# EasyEDA schematic SCH_directMessage.json

## Sheets
1 Sheet_1: TITLE: directMessage/MCU, display, power management; REV: 1.0; Date: 2022-07-14; Sheet: 1/1; Drawn By: dolendra vikas; Company: Your Company
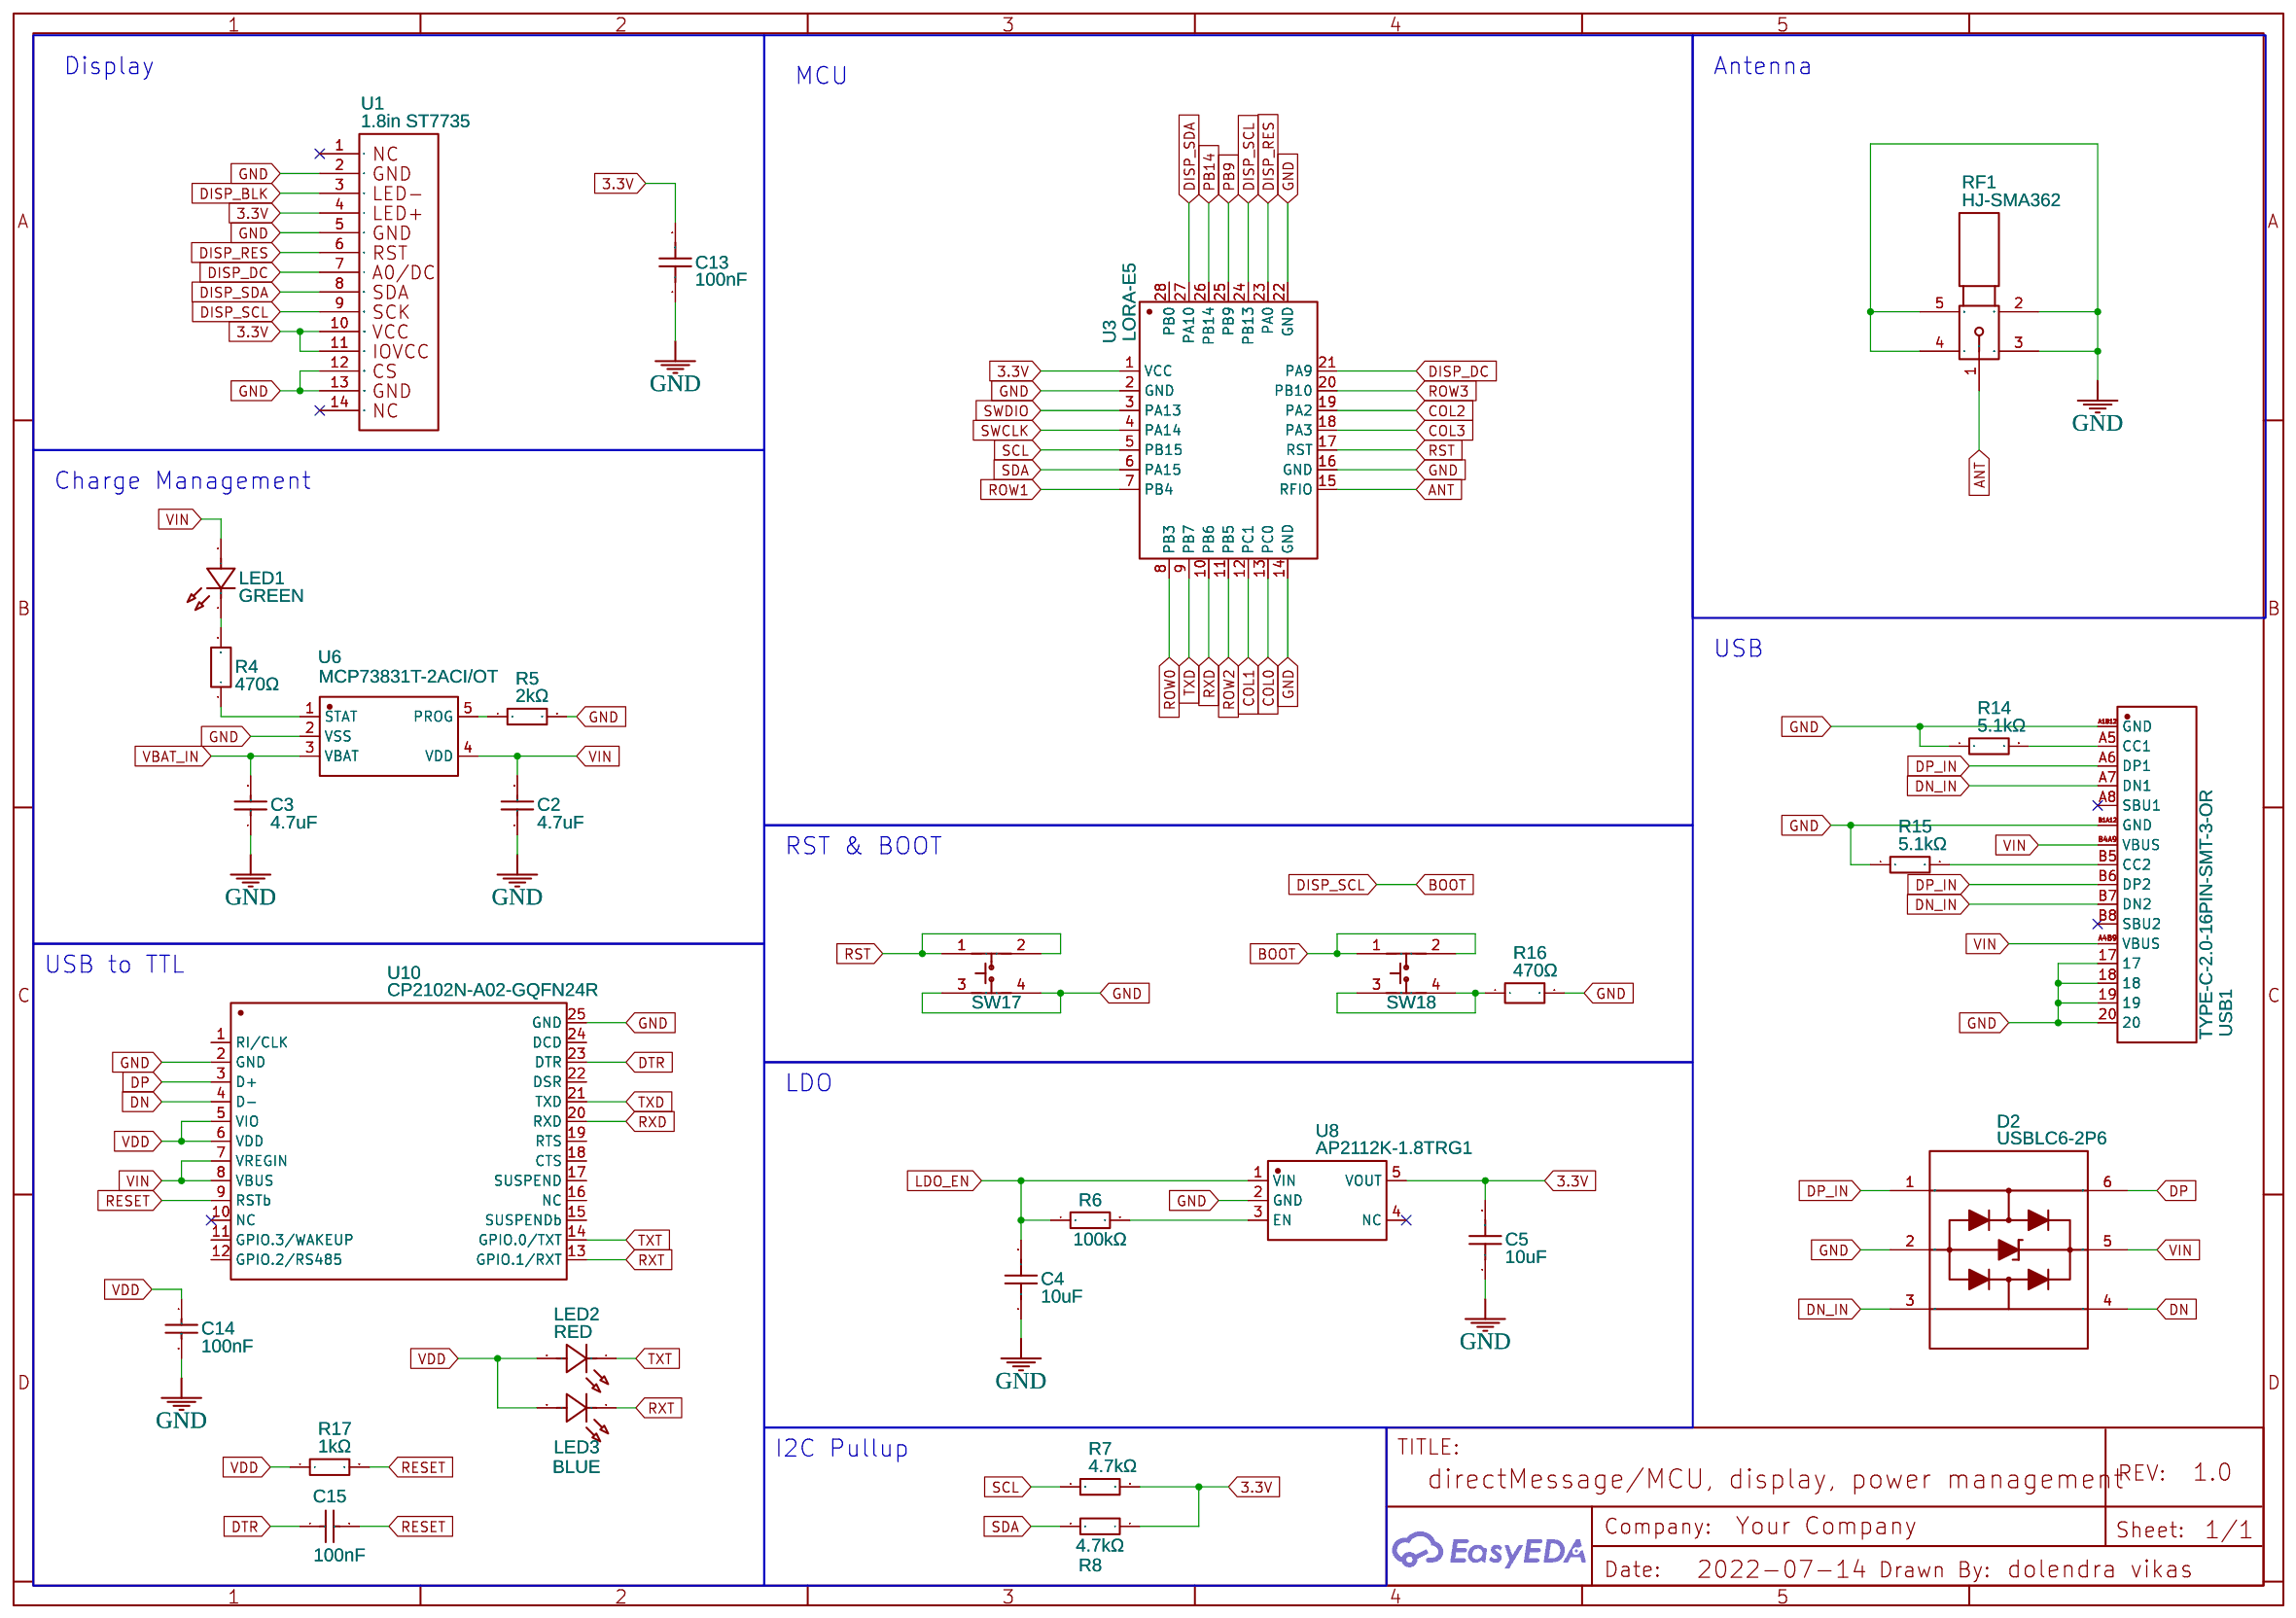
[diagram p0: Sheet_1]
2 Sheet_2: TITLE: directMessage/Sensors & Motor; Date: 2022-07-16
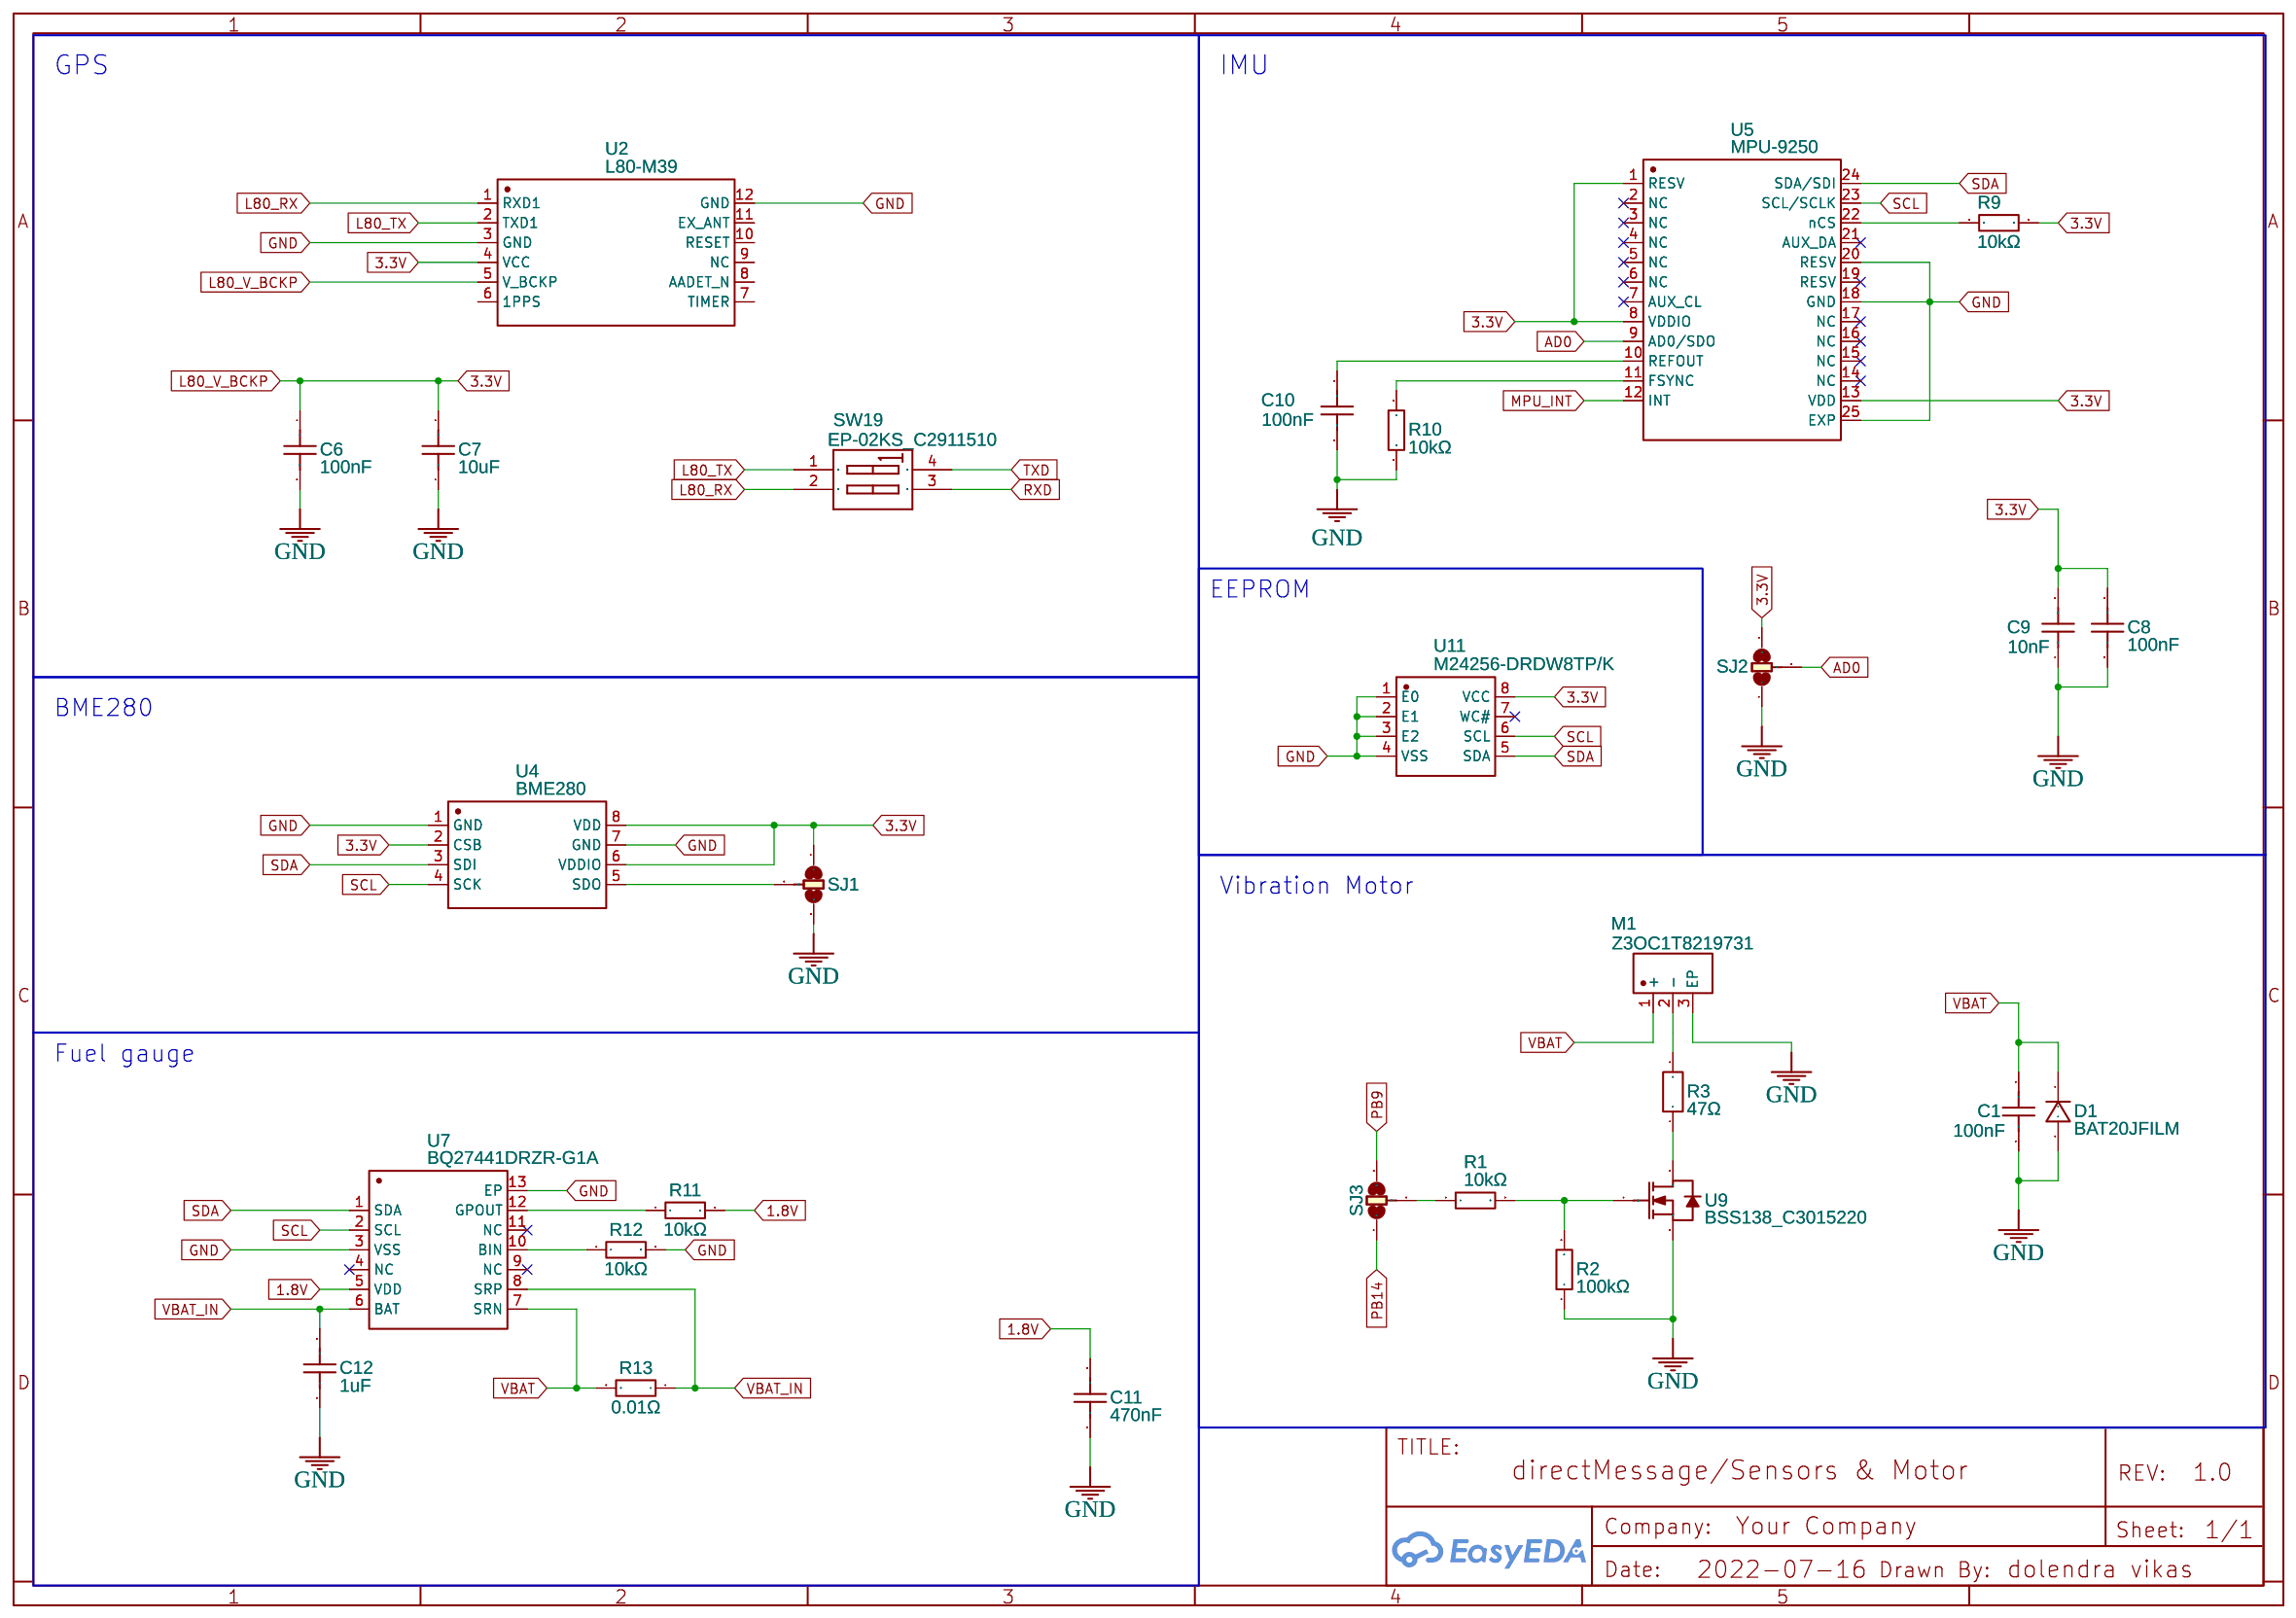
[diagram p1: Sheet_2]
3 Sheet_3: TITLE: directMessage/Conenctors & switches; Date: 2022-07-16
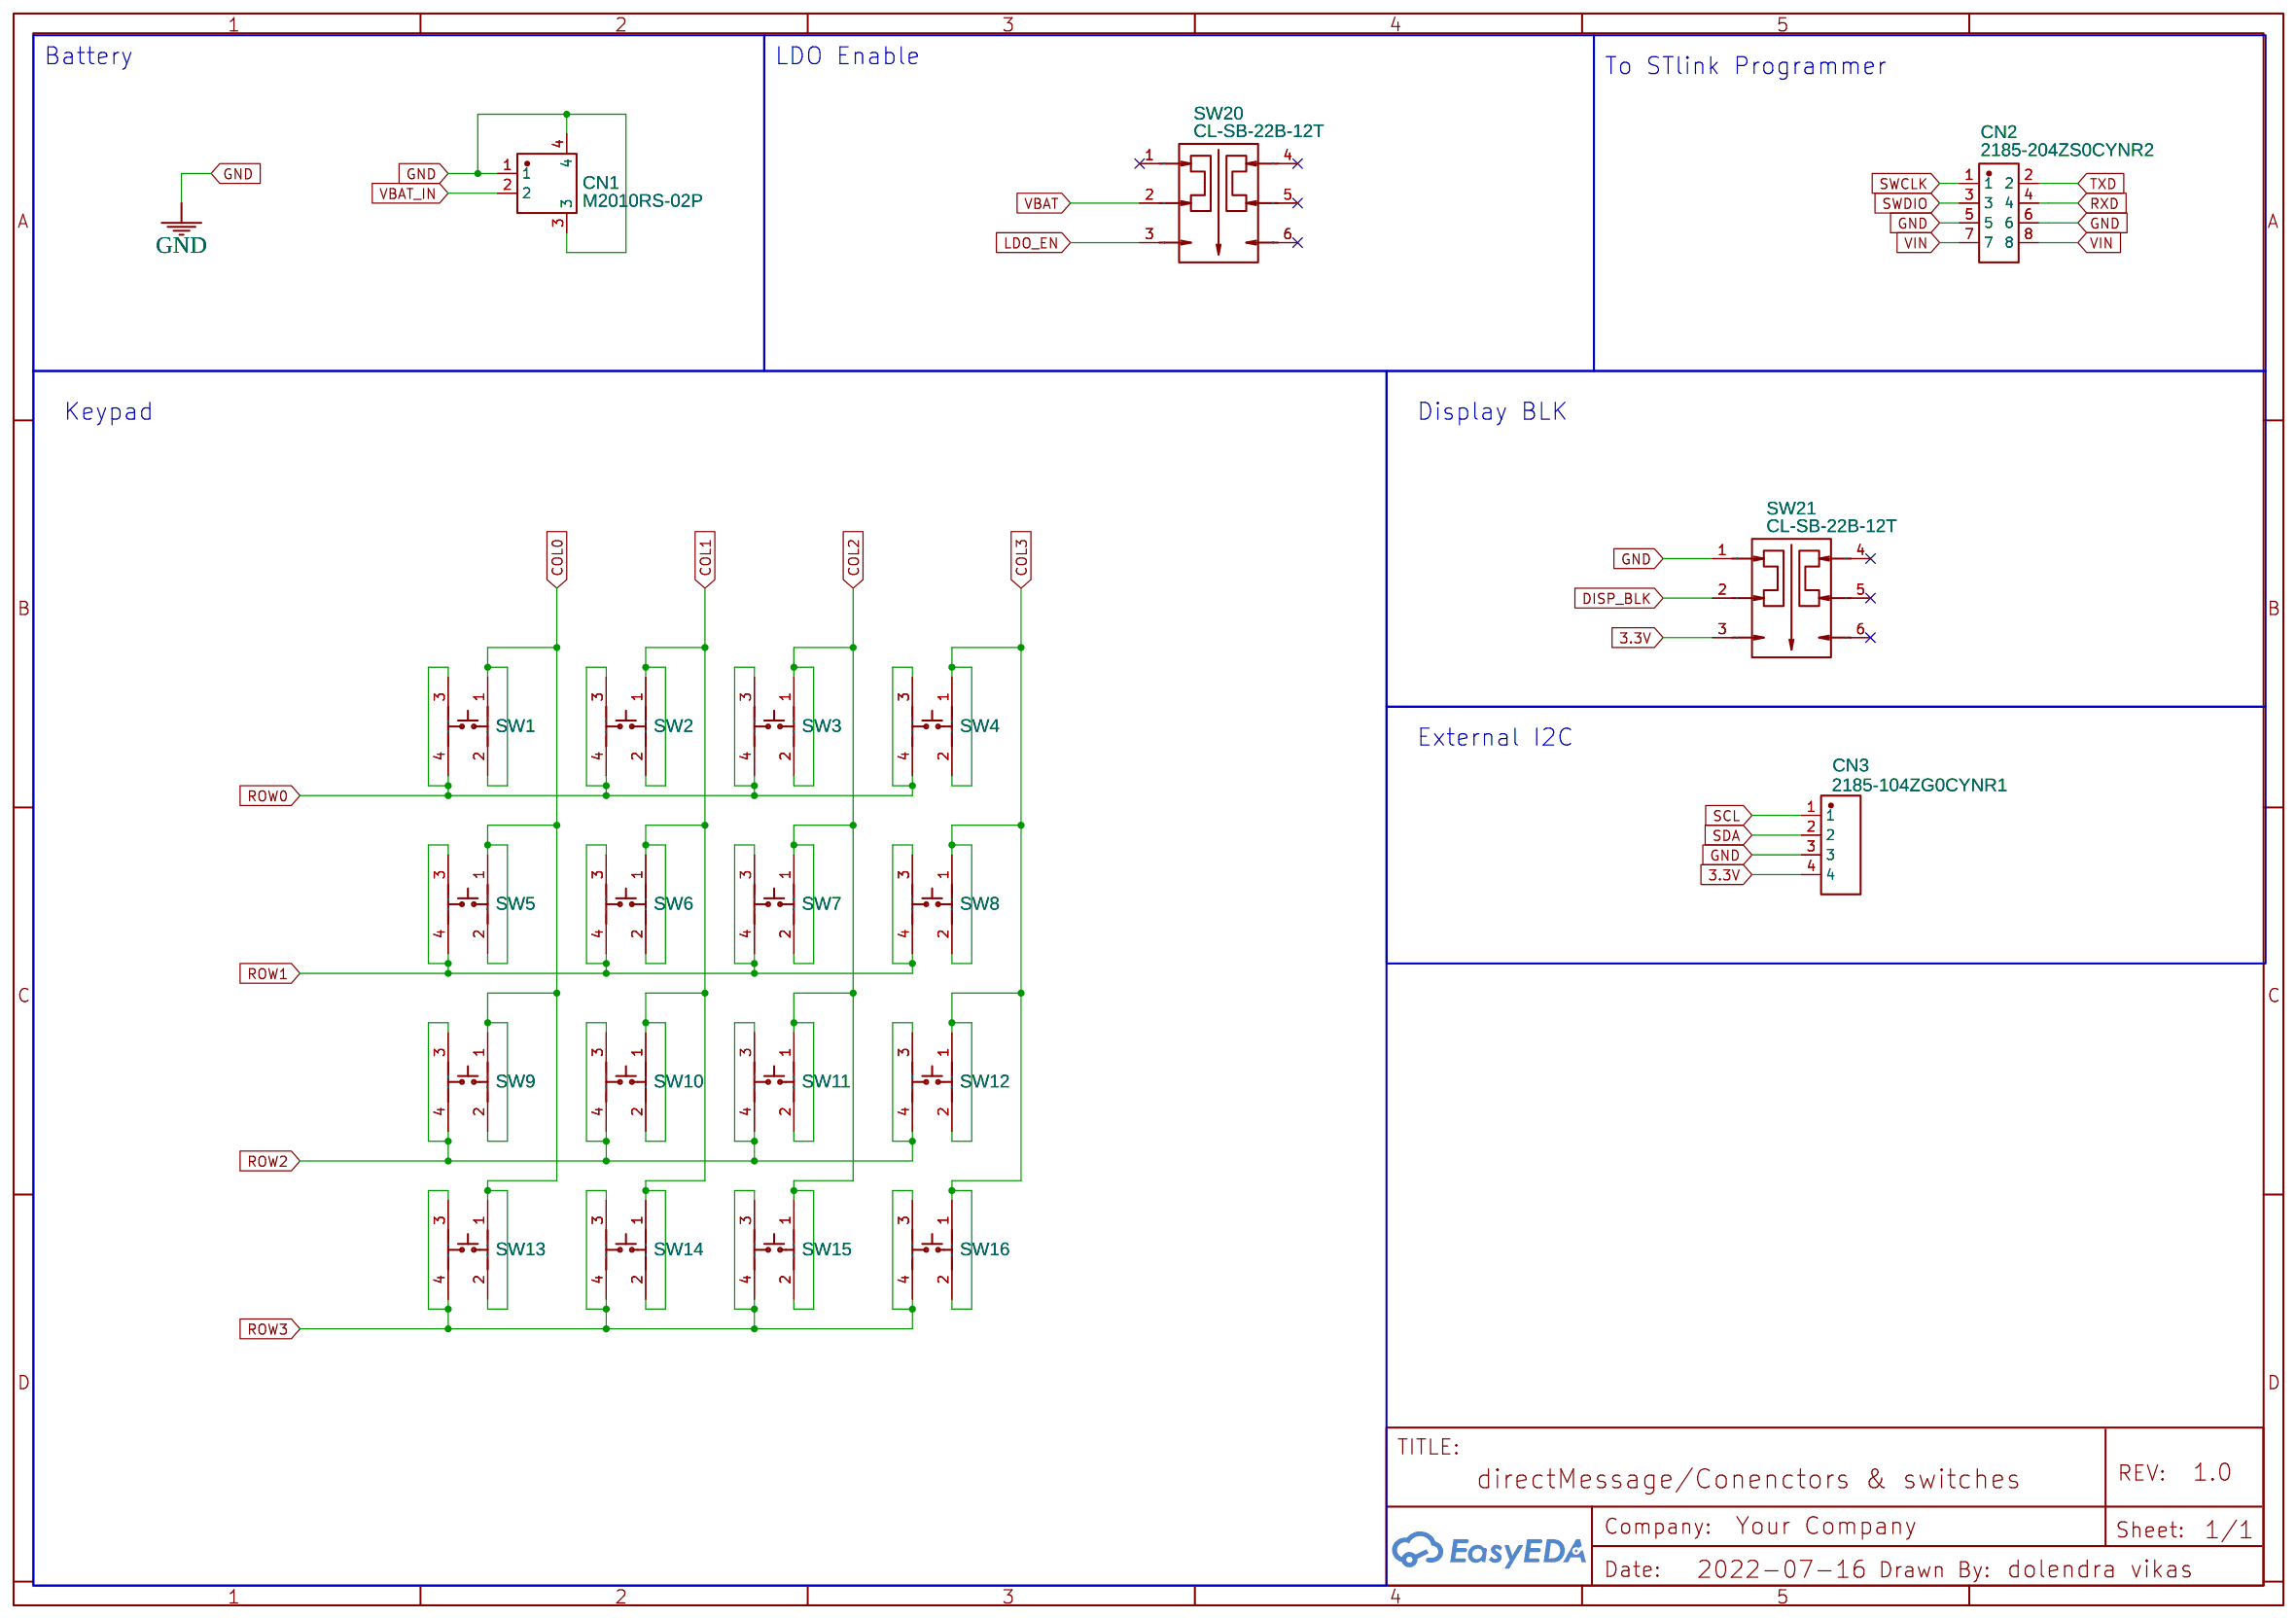
[diagram p2: Sheet_3]

## Parts
sheet Sheet_1
C2  4.7uF  [0603]
C3  4.7uF  [0603]
C4  10uF  [C0603]
C5  10uF  [C0603]
C13  100nF  [C0603]
C14  100nF  [C0603]
C15  100nF  [C0603]
D2  USBLC6-2P6  [SOT-666-6_L1.6-W1.2-P0.50-LS1.6-BR]
LED1  GREEN  [LED0603-RD_GREEN]
LED2  RED  [LED0603-RD_RED]
LED3  BLUE  [LED0603-RD_BLUE]
R4  470Ω  [R0603]
R5  2kΩ  [R0603]
R6  100kΩ  [R0603_NEW]
R7  4.7kΩ  [R0603]
R8  4.7kΩ  [R0603]
R14  5.1kΩ  [R0603]
R15  5.1kΩ  [R0603]
R16  470Ω  [R0603]
R17  1kΩ  [R0603]
RF1  HJ-SMA362  [SMA-SMD_HJ-SMA362]
SW17  SKRPABE010  [KEY-SMD_4P-L4.2-W3.2-P2.20-LS4.6]
SW18  SKRPABE010  [KEY-SMD_4P-L4.2-W3.2-P2.20-LS4.6]
U1  1.8in ST7735  [ST7735_1.8]
U3  LORA-E5  [SMD-28_L12.0-W12.0-P1.25_LORA-E5]
U6  MCP73831T-2ACI/OT  [SOT-23-5_L3.0-W1.7-P0.95-LS2.8-BR]
U8  AP2112K-1.8TRG1  [SOT-25_L3.0-W1.6-P0.95-LS2.8-BL]
U10  CP2102N-A02-GQFN24R  [QFN-24_L4.0-W4.0-P0.50-TL-EP2.6]
USB1  TYPE-C-2.0-16PIN-SMT-3-OR  [USB-SMD_TYPE-C16PIN-1]
sheet Sheet_2
C1  100nF  [C0603]
C6  100nF  [C0603]
C7  10uF  [C0603]
C8  100nF  [C0603]
C9  10nF  [C0603]
C10  100nF  [C0603]
C11  470nF  [C0603]
C12  1uF  [C0603]
D1  BAT20JFILM  [SOD-323_L1.8-W1.3-LS2.5-RD]
M1  Z3OC1T8219731  [VIBRATING-MOTOR-SMD_3P-C9900001680]
R1  10kΩ  [R0603]
R2  100kΩ  [R0603_NEW]
R3  47Ω  [R0603]
R9  10kΩ  [R0603]
R10  10kΩ  [R0603]
R11  10kΩ  [R0603]
R12  10kΩ  [R0603]
R13  0.01Ω  [R0603]
SJ1  SOLDERJUMPER_2WAY-OLDS  [SJ_3]
SJ2  SOLDERJUMPER_2WAY-OLDS  [SJ_3]
SJ3  SOLDERJUMPER_2WAY-OLDS  [SJ_3]
SW19  EP-02KS_C2911510  [SW-SMD_EP-02KS-LS5.4]
U2  L80-M39  [GSM-SMD_L80-M39]
U4  BME280  [LGA-8_BME280_BL]
U5  MPU-9250  [QFN-24_L3.0-W3.0-P0.40-BL-EP]
U7  BQ27441DRZR-G1A  [SON-12_L4.0-W2.5-P0.40-BL-EP]
U9  BSS138_C3015220  [SOT-23-3_L2.9-W1.3-P1.90-LS2.6-BR]
U11  M24256-DRDW8TP/K  [TSSOP-8_L4.4-W3.0-P0.65-LS6.4-BL-2]
sheet Sheet_3
CN1  M2010RS-02P  [CONN-SMD_M2010RS-02P]
CN2  2185-204ZS0CYNR2  [CONN-SMD_8P-P2.54-S3.50_L8.5-W10.2]
CN3  2185-104ZG0CYNR1  [CONN-SMD_4P-P2.54_L8.5-W10.2]
SW1  SKRPABE010  [KEY-SMD_4P-L4.2-W3.2-P2.20-LS4.6]
SW2  SKRPABE010  [KEY-SMD_4P-L4.2-W3.2-P2.20-LS4.6]
SW3  SKRPABE010  [KEY-SMD_4P-L4.2-W3.2-P2.20-LS4.6]
SW4  SKRPABE010  [KEY-SMD_4P-L4.2-W3.2-P2.20-LS4.6]
SW5  SKRPABE010  [KEY-SMD_4P-L4.2-W3.2-P2.20-LS4.6]
SW6  SKRPABE010  [KEY-SMD_4P-L4.2-W3.2-P2.20-LS4.6]
SW7  SKRPABE010  [KEY-SMD_4P-L4.2-W3.2-P2.20-LS4.6]
SW8  SKRPABE010  [KEY-SMD_4P-L4.2-W3.2-P2.20-LS4.6]
SW9  SKRPABE010  [KEY-SMD_4P-L4.2-W3.2-P2.20-LS4.6]
SW10  SKRPABE010  [KEY-SMD_4P-L4.2-W3.2-P2.20-LS4.6]
SW11  SKRPABE010  [KEY-SMD_4P-L4.2-W3.2-P2.20-LS4.6]
SW12  SKRPABE010  [KEY-SMD_4P-L4.2-W3.2-P2.20-LS4.6]
SW13  SKRPABE010  [KEY-SMD_4P-L4.2-W3.2-P2.20-LS4.6]
SW14  SKRPABE010  [KEY-SMD_4P-L4.2-W3.2-P2.20-LS4.6]
SW15  SKRPABE010  [KEY-SMD_4P-L4.2-W3.2-P2.20-LS4.6]
SW16  SKRPABE010  [KEY-SMD_4P-L4.2-W3.2-P2.20-LS4.6]
SW20  CL-SB-22B-12T  [SW-SMD_NIDEC_CL-SB-22B-12T]
SW21  CL-SB-22B-12T  [SW-SMD_NIDEC_CL-SB-22B-12T]

## Library data of the parts
C2 C3 = 0603 4.7UF CAPACITOR (SMD): Supplier Part: C108344; Supplier: LCSC; Manufacturer: FH; Manufacturer Part: 0603F475M100NT
C4 C5 C7 = 0603X106M6R3: Supplier: LCSC; Supplier Part: C123608; Manufacturer: Huaxin S&T; Contributor: LCSC; JLCPCB Part Class: Extended Part
C13 = GCM188R71H104KA57D: Supplier: LCSC; Manufacturer: MuRata; Supplier Part: C85864; JLCPCB Part Class: Extended Part
C14 C15 = FN18X104K500PBG: Supplier: LCSC; Supplier Part: C235731; Manufacturer: Prosperity Dielectrics; Contributor: LCSC; JLCPCB Part Class: Extended Part
D2 = USBLC6-2P6: Supplier: LCSC; Manufacturer: STMicroelectronics; Supplier Part: C15999; Paste Type: Extended Part; JLCPCB Part Class: Extended Part; Contributor: Станислав Яценко
LED1 = XL-1608SYGC-06: Supplier: LCSC; Supplier Part: C965805; Manufacturer: XINGLIGHT(成兴光); JLCPCB Part Class: Extended Part; Contributor: LCSC
LED2 = XL-1608SURC-06: Supplier: LCSC; Supplier Part: C965799; Manufacturer: XINGLIGHT(成兴光); JLCPCB Part Class: Extended Part; Contributor: LCSC
LED3 = XL-1608UBC-04: Supplier: LCSC; Supplier Part: C965807; Manufacturer: XINGLIGHT(成兴光); Contributor: LCSC; JLCPCB Part Class: Extended Part
R4 R16 = ERJPA3J471V: Supplier: LCSC; Supplier Part: C441888; Manufacturer: PANASONIC; Resistance (Ohms): 470; Contributor: LCSC; JLCPCB Part Class: Extended Part
R5 = ERJ-3EKF2001V: Supplier: LCSC; Supplier Part: C192167; Manufacturer: PANASONIC; Resistance (Ohms): 2K; Contributor: LCSC; JLCPCB Part Class: Extended Part
R2 R6 = ERJ3EKF1003V: Supplier: LCSC; Supplier Part: C189597; Manufacturer: PANASONIC; Resistance (Ohms): 100K; Contributor: LCSC; JLCPCB Part Class: Extended Part
R7 R8 = ERJ-3RBD4701V: Supplier: LCSC; Supplier Part: C191778; Manufacturer: PANASONIC; Resistance (Ohms): 4.7K; Contributor: LCSC; JLCPCB Part Class: Extended Part
R14 R15 = ERJ-3RBD5101V: Supplier: LCSC; Supplier Part: C191782; Manufacturer: PANASONIC; Resistance (Ohms): 5.1K; Contributor: LCSC; JLCPCB Part Class: Extended Part
R17 = ERJ-3EKF1001V: Supplier: LCSC; Supplier Part: C118155; Manufacturer: PANASONIC; Resistance (Ohms): 1K; Contributor: LCSC; JLCPCB Part Class: Extended Part
RF1 = HJ-SMA362: Supplier: LCSC; Supplier Part: C2905338; Manufacturer: 皇捷; Contributor: LCSC; JLCPCB Part Class: Extended Part
SW1-SW18 = SKRPABE010: Supplier: LCSC; Manufacturer: ALPS; Supplier Part: C115360; JLCPCB Part Class: Extended Part
U1 = 1.8in ST7735: Contributor: dolendra vikas
U3 = LORA-E5: Supplier: LCSC; Supplier Part: C9900002286; Manufacturer: null; Manufacturer Part: LoRa-E5; JLCPCB Part Class: Extended Part; Contributor: LCSC
U6 = MCP73831T-2ACI/OT: Supplier: LCSC; Supplier Part: C424093; Manufacturer: Microchip Tech; Contributor: LCSC; JLCPCB Part Class: Extended Part
U8 = AP2112K-1.8TRG1: Supplier: LCSC; Supplier Part: C176944; Manufacturer: Diodes Incorporated; Contributor: LCSC; JLCPCB Part Class: Extended Part
U10 = CP2102N-A02-GQFN24R: Supplier: LCSC; Supplier Part: C969151; Manufacturer: SILICON LABS(芯科); Contributor: LCSC; JLCPCB Part Class: Extended Part
USB1 = TYPE-C-2.0-16PIN-SMT-3-OR: Supplier: LCSC; Supplier Part: C2987387; Manufacturer: CIKI(皓富); Contributor: lcsc; JLCPCB Part Class: Extended Part
C1 C6 C8 C10 = C0603C104J5RAC: Supplier: LCSC; Supplier Part: C490602; Manufacturer: KEMET; Contributor: LCSC; JLCPCB Part Class: Extended Part
C9 = C0603C103J3GAC7867: Supplier: LCSC; Supplier Part: C140951; Manufacturer: KEMET; Contributor: LCSC; JLCPCB Part Class: Extended Part
C11 = GCM188R71E474KA64D: Supplier: LCSC; Supplier Part: C161219; Manufacturer: Murata Electronics; Contributor: LCSC; JLCPCB Part Class: Extended Part
C12 = GRM188R61E105KA12D: Supplier: LCSC; Manufacturer: MuRata; Supplier Part: C77046; JLCPCB Part Class: Extended Part
D1 = BAT20JFILM: Supplier Part: C155590; Supplier: LCSC; Manufacturer: STMicroelectronics; Contributor: LCSC; JLCPCB Part Class: Extended Part
M1 = Z3OC1T8219731: Supplier: LCSC; Supplier Part: C2894731; Manufacturer: KOTL(金龙机电); JLCPCB Part Class: Extended Part; Contributor: LCSC
R1 R9-R12 = ERJ3GEYJ103V: Supplier: LCSC; Manufacturer: PANASONIC; Resistance (Ohms): 10K; Contributor: LCSC; Supplier Part: C169849; JLCPCB Part Class: Extended Part
R3 = ERJUP3D47R0V: Supplier: LCSC; Supplier Part: C491217; Manufacturer: PANASONIC; Contributor: LCSC; JLCPCB Part Class: Extended Part
R13 = RTT03R010FTP: Supplier: LCSC; Manufacturer: RALEC; Resistance (Ohms): 0.01; Contributor: LCSC; Supplier Part: C158899; JLCPCB Part Class: Extended Part
SJ1-SJ3 = SOLDERJUMPER_2WAY-OLDS: Solder Jumper; Contributor: SparkFun
SW19 = EP-02KS_C2911510: Supplier: LCSC; Supplier Part: C2911510; Manufacturer: 韩国韩荣; Manufacturer Part: EP-02KS; Contributor: LCSC; JLCPCB Part Class: Extended Part
U2 = L80-M39: Supplier: LCSC; Manufacturer: Quectel; Supplier Part: C133488; JLCPCB Part Class: Extended Part
U4 = BME280: Supplier: LCSC; Manufacturer: Bosch; Contributor: LCSC; Supplier Part: C92489; JLCPCB Part Class: Extended Part
U5 = MPU-9250: Supplier: LCSC; Manufacturer: InvenSense; Contributor: LCSC; Supplier Part: C71459; JLCPCB Part Class: Extended Part
U7 = BQ27441DRZR-G1A: Supplier: LCSC; Supplier Part: C473397; Manufacturer: Texas Instruments; Contributor: LCSC; JLCPCB Part Class: Extended Part
U9 = BSS138_C3015220: Supplier: LCSC; Supplier Part: C3015220; Manufacturer: KUU; Manufacturer Part: BSS138; link: https://atta.szlcsc.com/upload/public/pdf/source/20220516/125DEF07DB3AB32C02C9AD402DEFFF8E.pdf; Contributor: lcsc
U11 = M24256-DRDW8TP/K: Supplier: LCSC; Supplier Part: C2061704; Manufacturer: ST(意法半导体); link: https://atta.szlcsc.com/upload/public/pdf/source/20210603/320AE2D9BBABA6B22CF64013D24EEC4B.pdf; Contributor: lcsc
CN1 = M2010RS-02P: Supplier: LCSC; Supplier Part: C520130; Manufacturer: XFCN(台湾兴飞); Contributor: LCSC; JLCPCB Part Class: Extended Part
CN2 = 2185-204ZS0CYNR2: Supplier: LCSC; Supplier Part: C721893; Manufacturer: Wcon(维峰电子); Contributor: LCSC; JLCPCB Part Class: Extended Part
CN3 = 2185-104ZG0CYNR1: Supplier: LCSC; Supplier Part: C721891; Manufacturer: Wcon(维峰电子); Contributor: LCSC; JLCPCB Part Class: Extended Part
SW20 SW21 = CL-SB-22B-12T: Supplier: LCSC; Supplier Part: C2921665; Manufacturer: NIDEC(尼得科); Contributor: LCSC

## Nets
1.8V: C11.2 R11.2 U7.5(VDD)
3.3V: C5.2 C6.1 C7.2 C8.1 C9.2 C13.2 CN3.4 R7.2 R8.1 R9.2 SJ1.1 SJ2.3 SW21.3 U1.4 U1.10 U1.11 U2.4(VCC) U2.5(V_BCKP) U3.1(VCC) U4.2(CSB) U4.6(VDDIO) U4.8(VDD) U5.1(RESV) U5.8(VDDIO) U5.13(VDD) U8.5(VOUT) U11.8(VCC)
GND: C1.2 C2.1 C3.1 C4.1 C5.1 C6.2 C7.1 C8.2 C9.1 C10.2 C11.1 C12.1 C13.1 C14.2 CN1.1 CN1.3 CN1.4 CN2.5 CN2.6 CN3.3 D1.2(A) D2.2(GND) M1.3(EP) R2.1 R5.2 R10.2 R12.2 R14.1 R15.1 R16.2 RF1.2 RF1.3 RF1.4 RF1.5 SJ1.3 SJ2.1 SW17.3 SW17.4 SW21.1 U1.2 U1.5 U1.12 U1.13 U2.3(GND) U2.12(GND) U3.2(GND) U3.14(GND) U3.16(GND) U3.22(GND) U4.1(GND) U4.7(GND) U5.18(GND) U5.20(RESV) U5.25(EXP) U6.2(VSS) U7.3(VSS) U7.13(EP) U8.2(GND) U9.2(S) U10.2(GND) U10.25(GND) U11.1(E0) U11.2(E1) U11.3(E2) U11.4(VSS) USB1.17 USB1.18 USB1.19 USB1.20 USB1.A1B12(GND) USB1.B1A12(GND)
VBAT: C1.1 D1.1(K) M1.1(+) R13.2 SW20.2 U7.7(SRN)
VBAT_IN: C3.2 C12.2 CN1.2 R13.1 U6.3(VBAT) U7.6(BAT) U7.8(SRP)
VDD: C14.1 LED2.2(A) LED3.2(A) R17.1 U10.5(VIO) U10.6(VDD)
VIN: C2.2 CN2.7 CN2.8 D2.5(VBUS) LED1.2(A) U6.4(VDD) U10.7(VREGIN) U10.8(VBUS) USB1.A4B9(VBUS) USB1.B4A9(VBUS)
AD0: SJ2.2 U5.9(AD0/SDO)
ANT: RF1.1 U3.15(RFIO)
BOOT: SW18.1 SW18.2 U1.9 U3.24(PB13)
COL0: SW1.1 SW1.2 SW5.1 SW5.2 SW9.1 SW9.2 SW13.1 SW13.2 U3.13(PC0)
COL1: SW2.1 SW2.2 SW6.1 SW6.2 SW10.1 SW10.2 SW14.1 SW14.2 U3.12(PC1)
COL2: SW3.1 SW3.2 SW7.1 SW7.2 SW11.1 SW11.2 SW15.1 SW15.2 U3.19(PA2)
COL3: SW4.1 SW4.2 SW8.1 SW8.2 SW12.1 SW12.2 SW16.1 SW16.2 U3.18(PA3)
DISP_BLK: SW21.2 U1.3
DISP_DC: U1.7 U3.21(PA9)
DISP_RES: U1.6 U3.23(PA0)
DISP_SDA: U1.8 U3.27(PA10)
DN: D2.4(I/O2) U10.4(D-)
DN_IN: D2.3(I/O2) USB1.A7(DN1) USB1.B7(DN2)
DP: D2.6(I/O1) U10.3(D+)
DP_IN: D2.1(I/O1) USB1.A6(DP1) USB1.B6(DP2)
DTR: C15.1 U10.23(DTR)
L80_RX: SW19.2(A2) U2.1(RXD1)
L80_TX: SW19.1(A1) U2.2(TXD1)
LDO_EN: C4.2 R6.1 SW20.3 U8.1(VIN)
MPU_INT: U5.12(INT)
PB9: SJ3.3 U3.25(PB9)
PB14: SJ3.1 U3.26(PB14)
RESET: C15.2 R17.2 U10.9(RSTb)
ROW0: SW1.3 SW1.4 SW2.3 SW2.4 SW3.3 SW3.4 SW4.3 SW4.4 U3.8(PB3)
ROW1: SW5.3 SW5.4 SW6.3 SW6.4 SW7.3 SW7.4 SW8.3 SW8.4 U3.7(PB4)
ROW2: SW9.3 SW9.4 SW10.3 SW10.4 SW11.3 SW11.4 SW12.3 SW12.4 U3.11(PB5)
ROW3: SW13.3 SW13.4 SW14.3 SW14.4 SW15.3 SW15.4 SW16.3 SW16.4 U3.20(PB10)
RST: SW17.1 SW17.2 U3.17(RST)
RXD: CN2.4 SW19.3(B2) U3.10(PB6) U10.20(RXD)
RXT: LED3.1(K) U10.13(GPIO.1/RXT)
SCL: CN3.1 R7.1 U3.5(PB15) U4.4(SCK) U5.23(SCL/SCLK) U7.2(SCL) U11.6(SCL)
SDA: CN3.2 R8.2 U3.6(PA15) U4.3(SDI) U5.24(SDA/SDI) U7.1(SDA) U11.5(SDA)
SWCLK: CN2.1 U3.4(PA14)
SWDIO: CN2.3 U3.3(PA13)
TXD: CN2.2 SW19.4(B1) U3.9(PB7) U10.21(TXD)
TXT: LED2.1(K) U10.14(GPIO.0/TXT)
Net-(C10-1): C10.1 U5.10(REFOUT)
Net-(LED1-1): LED1.1(K) R4.2
Net-(M1-2): M1.2(-) R3.2
Net-(R1-1): R1.1 SJ3.2
Net-(R1-2): R1.2 R2.2 U9.1(G)
Net-(R3-1): R3.1 U9.3(D)
Net-(R4-1): R4.1 U6.1(STAT)
Net-(R5-1): R5.1 U6.5(PROG)
Net-(R6-2): R6.2 U8.3(EN)
Net-(R9-1): R9.1 U5.22(nCS)
Net-(R10-1): R10.1 U5.11(FSYNC)
Net-(R11-1): R11.1 U7.12(GPOUT)
Net-(R12-1): R12.1 U7.10(BIN)
Net-(R14-2): R14.2 USB1.A5(CC1)
Net-(R15-2): R15.2 USB1.B5(CC2)
Net-(R16-1): R16.1 SW18.3 SW18.4
Net-(SJ1-2): SJ1.2 U4.5(SDO)

Not connected (* = marked no-connect by the designer): SW20 1* 4* 5* 6*; SW21 4* 5* 6*; U1 1* 14*; U2 6(1PPS) 7(TIMER) 8(AADET_N) 9(NC) 10(RESET) 11(EX_ANT); U3 28(PB0); U5 2(NC)* 3(NC)* 4(NC)* 5(NC)* 6(NC)* 7(AUX_CL)* 14(NC)* 15(NC)* 16(NC)* 17(NC)* 19(RESV)* 21(AUX_DA)*; U7 4(NC)* 9(NC)* 11(NC)*; U8 4(NC)*; U10 1(RI/CLK) 10(NC)* 11(GPIO.3/WAKEUP) 12(GPIO.2/RS485) 15(SUSPENDb) 16(NC) 17(SUSPEND) 18(CTS) 19(RTS) 22(DSR) 24(DCD); U11 7(WC#)*; USB1 A8(SBU1)* B8(SBU2)*

## Notes on the sheets
sheet 1
- Display
- MCU
- Antenna
- Charge Management
- USB
- RST & BOOT
- USB to TTL
- LDO
- I2C Pullup
sheet 2
- GPS
- IMU
- EEPROM
- BME280
- Vibration Motor
- Fuel gauge
sheet 3
- Battery
- LDO Enable
- To STlink Programmer
- Keypad
- Display BLK
- External I2C
